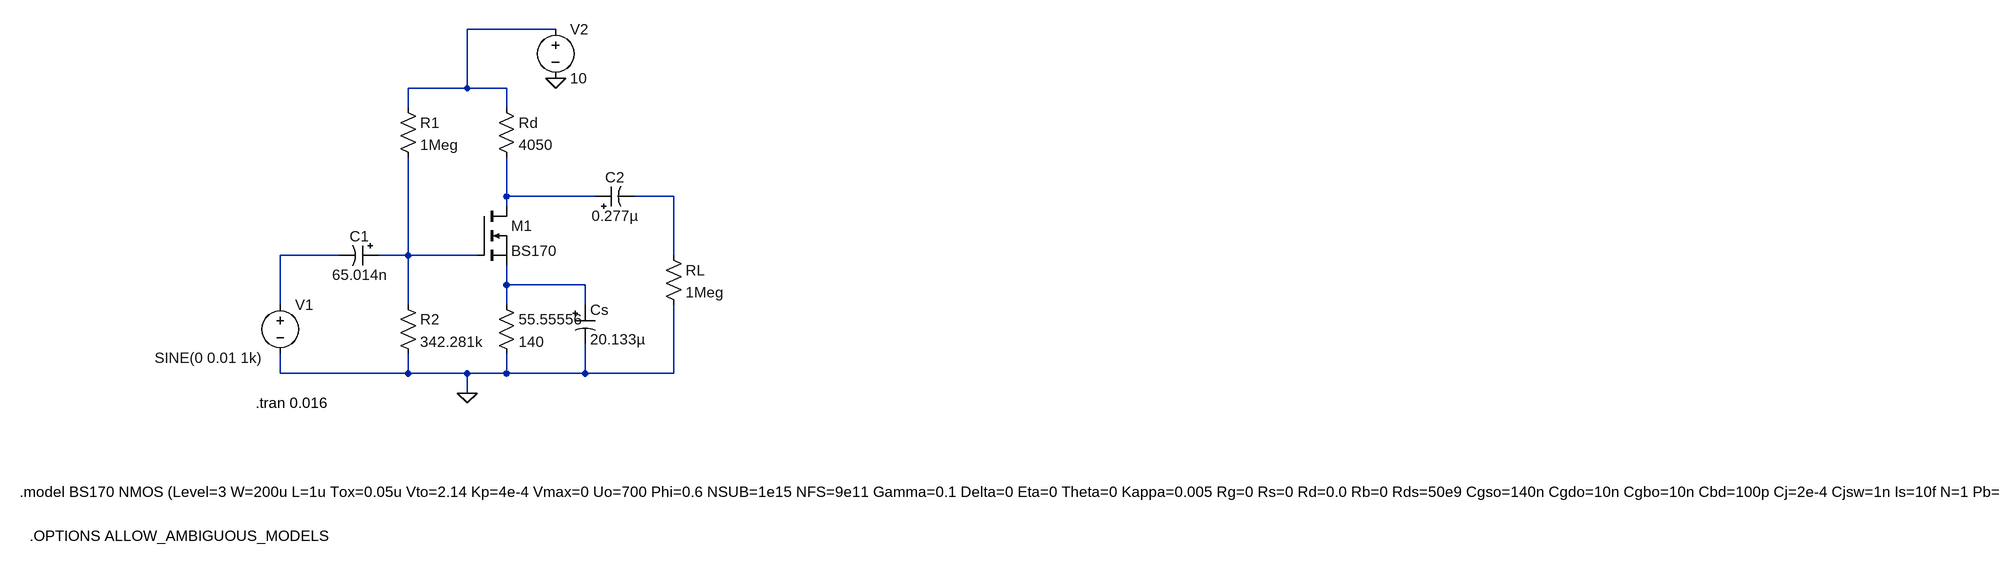
[diagram p0: schematic NNM24EE057_koustubh.asc]
NNM24EE057_koustubh.asc, the LTspice schematic file:
Version 4.1
SHEET 1 2960 680
WIRE 80 -256 -64 -256
WIRE -64 -160 -64 -256
WIRE -64 -160 -160 -160
WIRE 0 -160 -64 -160
WIRE -160 -128 -160 -160
WIRE 0 -128 0 -160
WIRE 0 16 0 -48
WIRE 144 16 0 16
WIRE 272 16 208 16
WIRE 0 32 0 16
WIRE -272 112 -368 112
WIRE -160 112 -160 -48
WIRE -160 112 -208 112
WIRE -48 112 -160 112
WIRE 272 112 272 16
WIRE 0 160 0 128
WIRE 128 160 0 160
WIRE -368 192 -368 112
WIRE -160 192 -160 112
WIRE 0 192 0 160
WIRE 128 192 128 160
WIRE -368 304 -368 272
WIRE -160 304 -160 272
WIRE -160 304 -368 304
WIRE -64 304 -160 304
WIRE 0 304 0 272
WIRE 0 304 -64 304
WIRE 128 304 128 256
WIRE 128 304 0 304
WIRE 272 304 272 192
WIRE 272 304 128 304
WIRE -64 336 -64 304
FLAG -64 336 0
FLAG 80 -176 0
SYMBOL nmos -48 32 R0
SYMATTR InstName M1
SYMATTR Value BS170
SYMBOL res -176 -144 R0
SYMATTR InstName R1
SYMATTR Value 1Meg
SYMBOL res -176 176 R0
SYMATTR InstName R2
SYMATTR Value 342.281k
SYMBOL res -16 -144 R0
SYMATTR InstName Rd
SYMATTR Value 4050
SYMBOL res -16 176 R0
SYMATTR InstName 55.55556
SYMATTR Value 140
SYMBOL polcap -208 96 R90
WINDOW 0 0 32 VBottom 2
WINDOW 3 32 32 VTop 2
SYMATTR InstName C1
SYMATTR Value 65.014n
SYMBOL polcap 144 32 R270
WINDOW 0 32 32 VTop 2
WINDOW 3 0 32 VBottom 2
SYMATTR InstName C2
SYMATTR Value 0.277µ
SYMBOL polcap 112 192 R0
SYMATTR InstName Cs
SYMATTR Value 20.133µ
SYMBOL voltage -368 176 R0
WINDOW 3 -204 102 Left 2
WINDOW 123 0 0 Left 0
WINDOW 39 0 0 Left 0
SYMATTR Value SINE(0 0.01 1k)
SYMATTR InstName V1
SYMBOL voltage 80 -272 R0
WINDOW 123 0 0 Left 0
WINDOW 39 0 0 Left 0
SYMATTR InstName V2
SYMATTR Value 10
SYMBOL res 256 96 R0
SYMATTR InstName RL
SYMATTR Value 1Meg
TEXT -792 496 Left 2 !.model BS170 NMOS (Level=3 W=200u L=1u Tox=0.05u Vto=2.14 Kp=4e-4 Vmax=0 Uo=700 Phi=0.6 NSUB=1e15 NFS=9e11 Gamma=0.1 Delta=0 Eta=0 Theta=0 Kappa=0.005 Rg=0 Rs=0 Rd=0.0 Rb=0 Rds=50e9 Cgso=140n Cgdo=10n Cgbo=10n Cbd=100p Cj=2e-4 Cjsw=1n Is=10f N=1 Pb=.8)
TEXT -408 352 Left 2 !.tran 0.016
TEXT -776 568 Left 2 !.OPTIONS ALLOW_AMBIGUOUS_MODELS

The netlist it stands for:
* NNM24EE057_koustubh.asc
M1 N002 N005 N006 N006 BS170
R1 N001 N005 1Meg
R2 N005 0 342.281k
Rd N001 N002 4050
R§55.55556 N006 0 140
C1 N005 N004 65.014n
C2 N002 N003 0.277µ
Cs N006 0 20.133µ
V1 N004 0 SINE(0 0.01 1k)
V2 N001 0 10
RL N003 0 1Meg
.model NMOS NMOS
.model PMOS PMOS
.lib standard.mos
.model BS170 NMOS (Level=3 W=200u L=1u Tox=0.05u Vto=2.14 Kp=4e-4 Vmax=0 Uo=700 Phi=0.6 NSUB=1e15 NFS=9e11 Gamma=0.1 Delta=0 Eta=0 Theta=0 Kappa=0.005 Rg=0 Rs=0 Rd=0.0 Rb=0 Rds=50e9 Cgso=140n Cgdo=10n Cgbo=10n Cbd=100p Cj=2e-4 Cjsw=1n Is=10f N=1 Pb=.8)
.tran 0.016
.OPTIONS ALLOW_AMBIGUOUS_MODELS
.backanno
.end